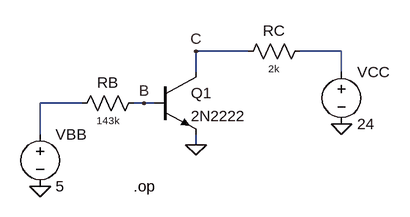
[diagram p0: schematic 002 TJB.asc]
002 TJB.asc, the LTspice schematic file:
Version 4
SHEET 1 880 680
WIRE 240 80 160 80
WIRE 384 80 320 80
WIRE 160 112 160 80
WIRE 384 112 384 80
WIRE -16 160 -80 160
WIRE 80 160 64 160
WIRE 96 160 80 160
WIRE -80 208 -80 160
WIRE 160 224 160 208
FLAG -80 288 0
FLAG 384 192 0
FLAG 160 80 C
FLAG 80 160 B
FLAG 160 224 0
SYMBOL npn 96 112 R0
SYMATTR InstName Q1
SYMATTR Value 2N2222
SYMBOL voltage 384 96 R0
SYMATTR InstName VCC
SYMATTR Value 24
SYMBOL res 336 64 R90
WINDOW 0 0 56 VBottom 2
WINDOW 3 32 56 VTop 1
SYMATTR InstName RC
SYMATTR Value 2k
SYMBOL res 80 144 R90
WINDOW 0 0 56 VBottom 2
WINDOW 3 32 56 VTop 1
SYMATTR InstName RB
SYMATTR Value 143k
SYMBOL voltage -80 192 R0
SYMATTR InstName VBB
SYMATTR Value 5
TEXT 64 288 Left 2 !.op

The netlist it stands for:
* 002 TJB.asc
Q1 C B 0 0 2N2222
VCC N001 0 24
RC N001 C 2k
RB B N002 143k
VBB N002 0 5
.model NPN NPN
.model PNP PNP
.lib standard.bjt
.op
.backanno
.end